# Altium schematic sheet Current_Thermal.SchDoc
size 259 x 167 mm; SheetNumber: 12; SheetTotal: 12
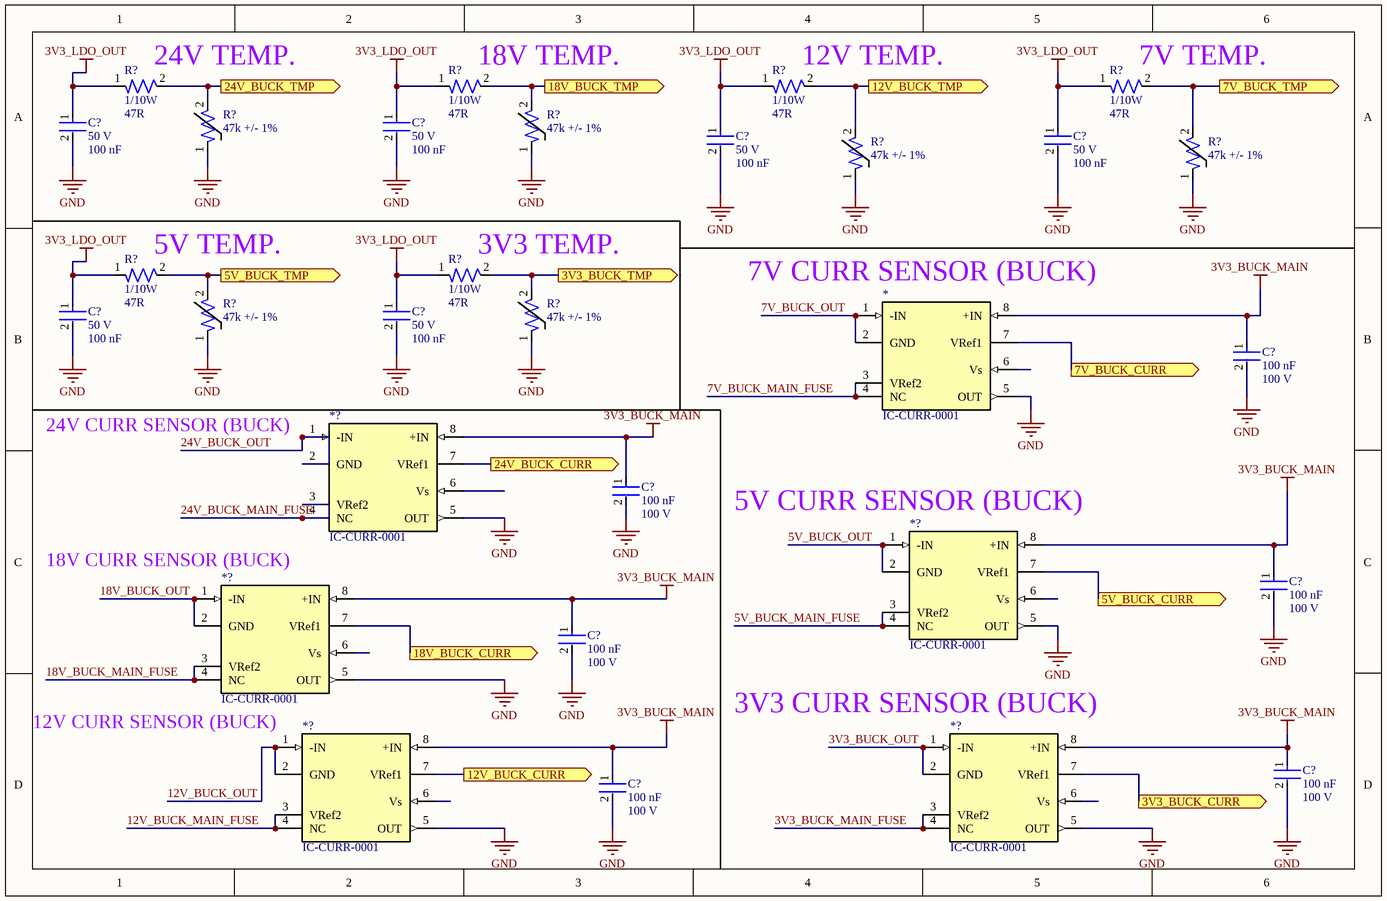
[diagram p0: Current_Thermal.SchDoc]

## Parts
(Parts that share a designator on the sheet are numbered #1, #2 ... from top to bottom, then left to right.)
*  IC-CURR-0001
*?#1  IC-CURR-0001
*?#2  IC-CURR-0001
*?#3  IC-CURR-0001
*?#4  IC-CURR-0001
*?#5  IC-CURR-0001
C?#1  Voltage Rating: 50 V  Capacitance: 100 nF  [CAP-0805]  (hidden comment: CC0805KRX7R9BB104)
C?#2  Voltage Rating: 50 V  Capacitance: 100 nF  [CAP-0805]  (hidden comment: CC0805KRX7R9BB104)
C?#3  Voltage Rating: 50 V  Capacitance: 100 nF  [CAP-0805]  (hidden comment: CC0805KRX7R9BB104)
C?#4  Voltage Rating: 50 V  Capacitance: 100 nF  [CAP-0805]  (hidden comment: CC0805KRX7R9BB104)
C?#5  Voltage Rating: 50 V  Capacitance: 100 nF  [CAP-0805]  (hidden comment: CC0805KRX7R9BB104)
C?#6  Voltage Rating: 50 V  Capacitance: 100 nF  [CAP-0805]  (hidden comment: CC0805KRX7R9BB104)
C?#7  Capacitance: 100 nF  Voltage: 100 V  [CAP-0603]  (hidden comment: CC0603KRX7R0BB104)
C?#8  Capacitance: 100 nF  Voltage: 100 V  [CAP-0603]  (hidden comment: CC0603KRX7R0BB104)
C?#9  Capacitance: 100 nF  Voltage: 100 V  [CAP-0603]  (hidden comment: CC0603KRX7R0BB104)
C?#10  Capacitance: 100 nF  Voltage: 100 V  [CAP-0603]  (hidden comment: CC0603KRX7R0BB104)
C?#11  Capacitance: 100 nF  Voltage: 100 V  [CAP-0603]  (hidden comment: CC0603KRX7R0BB104)
C?#12  Capacitance: 100 nF  Voltage: 100 V  [CAP-0603]  (hidden comment: CC0603KRX7R0BB104)
R?#1  Power: 1/10W  Resistance: 47R  [RES-0603]  (hidden comment: RC0603FR-0747RL)
R?#2  Power: 1/10W  Resistance: 47R  [RES-0603]  (hidden comment: RC0603FR-0747RL)
R?#3  Power: 1/10W  Resistance: 47R  [RES-0603]  (hidden comment: RC0603FR-0747RL)
R?#4  Power: 1/10W  Resistance: 47R  [RES-0603]  (hidden comment: RC0603FR-0747RL)
R?#5  Resistance: 47k +/- 1%  [RES-0402]  (hidden comment: TMP6431DECR)
R?#6  Resistance: 47k +/- 1%  [RES-0402]  (hidden comment: TMP6431DECR)
R?#7  Resistance: 47k +/- 1%  [RES-0402]  (hidden comment: TMP6431DECR)
R?#8  Resistance: 47k +/- 1%  [RES-0402]  (hidden comment: TMP6431DECR)
R?#9  Power: 1/10W  Resistance: 47R  [RES-0603]  (hidden comment: RC0603FR-0747RL)
R?#10  Power: 1/10W  Resistance: 47R  [RES-0603]  (hidden comment: RC0603FR-0747RL)
R?#11  Resistance: 47k +/- 1%  [RES-0402]  (hidden comment: TMP6431DECR)
R?#12  Resistance: 47k +/- 1%  [RES-0402]  (hidden comment: TMP6431DECR)

## Ports
3V3_BUCK_CURR (out), 3V3_BUCK_TMP (out), 5V_BUCK_CURR (out), 5V_BUCK_TMP (out), 7V_BUCK_CURR (out), 7V_BUCK_TMP (out), 12V_BUCK_CURR (out), 12V_BUCK_TMP (out), 18V_BUCK_CURR (out), 18V_BUCK_TMP (out), 24V_BUCK_CURR (out), 24V_BUCK_TMP (out)

## Nets
3V3_BUCK_MAIN: *.8(+IN) *?#1.8(+IN) *?#2.8(+IN) *?#3.8(+IN) *?#4.8(+IN) *?#5.8(+IN) C?#7.1 C?#8.1 C?#9.1 C?#10.1 C?#11.1 C?#12.1
3V3_LDO_OUT: C?#1.1 C?#2.1 C?#3.1 C?#4.1 C?#5.1 C?#6.1 R?#1.1 R?#2.1 R?#3.1 R?#4.1 R?#9.1 R?#10.1
GND: *.5(OUT) *?#1.5(OUT) *?#2.5(OUT) *?#3.5(OUT) *?#4.5(OUT) *?#5.5(OUT) C?#1.2 C?#2.2 C?#3.2 C?#4.2 C?#5.2 C?#6.2 C?#7.2 C?#8.2 C?#9.2 C?#10.2 C?#11.2 C?#12.2 R?#5.1 R?#6.1 R?#7.1 R?#8.1 R?#11.1 R?#12.1
3V3_BUCK_CURR: *?#5.7(VRef1) ; port 3V3_BUCK_CURR
3V3_BUCK_MAIN_FUSE: *?#5.3(VRef2) *?#5.4(NC)
3V3_BUCK_OUT: *?#5.1(-IN) *?#5.2(GND)
3V3_BUCK_TMP: R?#10.2 R?#12.2 ; port 3V3_BUCK_TMP
5V_BUCK_CURR: *?#2.7(VRef1) ; port 5V_BUCK_CURR
5V_BUCK_MAIN_FUSE: *?#2.3(VRef2) *?#2.4(NC)
5V_BUCK_OUT: *?#2.1(-IN) *?#2.2(GND)
5V_BUCK_TMP: R?#9.2 R?#11.2 ; port 5V_BUCK_TMP
7V_BUCK_CURR: *.7(VRef1) ; port 7V_BUCK_CURR
7V_BUCK_MAIN_FUSE: *.3(VRef2) *.4(NC)
7V_BUCK_OUT: *.1(-IN) *.2(GND)
7V_BUCK_TMP: R?#4.2 R?#8.2 ; port 7V_BUCK_TMP
12V_BUCK_CURR: *?#4.7(VRef1) ; port 12V_BUCK_CURR
12V_BUCK_MAIN_FUSE: *?#4.3(VRef2) *?#4.4(NC)
12V_BUCK_OUT: *?#4.1(-IN) *?#4.2(GND)
12V_BUCK_TMP: R?#3.2 R?#7.2 ; port 12V_BUCK_TMP
18V_BUCK_CURR: *?#3.7(VRef1) ; port 18V_BUCK_CURR
18V_BUCK_MAIN_FUSE: *?#3.3(VRef2) *?#3.4(NC)
18V_BUCK_OUT: *?#3.1(-IN) *?#3.2(GND)
18V_BUCK_TMP: R?#2.2 R?#6.2 ; port 18V_BUCK_TMP
24V_BUCK_CURR: *?#1.7(VRef1) ; port 24V_BUCK_CURR
24V_BUCK_MAIN_FUSE: *?#1.3(VRef2) *?#1.4(NC)
24V_BUCK_OUT: *?#1.1(-IN) *?#1.2(GND)
24V_BUCK_TMP: R?#1.2 R?#5.2 ; port 24V_BUCK_TMP

Not connected (* = marked no-connect by the designer): * 6(Vs); *?#1 6(Vs); *?#2 6(Vs); *?#3 6(Vs); *?#4 6(Vs); *?#5 6(Vs)

## Notes on the sheet
- (near R?#1) 24V TEMP.
- (near R?#2) 18V TEMP.
- (near R?#3) 12V TEMP.
- (near R?#4) 7V TEMP.
- (near R?#9) 5V TEMP.
- (near R?#10) 3V3 TEMP.
- (near *) 7V CURR SENSOR (BUCK)
- 24V CURR SENSOR (BUCK)
- (near *?#2) 5V CURR SENSOR (BUCK)
- (near *?#3) 18V CURR SENSOR (BUCK)
- (near *?#5) 3V3 CURR SENSOR (BUCK)
- (near *?#3) 12V CURR SENSOR (BUCK)

## Library data of the parts
* *?#1-*?#5 = IC-CURR-0001: Current Sense Amplifier 1 Circuit 8-MSOP
C?#1-C?#6 = CAP-0.1U-0002: CAP CER 0.1UF 50V X7R 0805; ComponentLink2Description: Datasheet; ComponentLink2URL: https://www.yageo.com/upload/media/product/productsearch/datasheet/mlcc/UPY-GPHC_X7R_6.3V-to-250V_24.pdf; Device Class: Ceramic; Size: 0805
C?#7-C?#12 = CAP-100N-0001: CAP CER 0.1UF 100V X7R 0603; Device Class: Ceramic; Size: 0603; ComponentLink1Description: Datasheet; ComponentLink1URL: https://www.yageo.com/upload/media/product/app/datasheet/mlcc/upy-np0x7r_mv_100-to-630v.pdf
R?#1-R?#4 R?#9 R?#10 = RES-47-0001: RES 47 OHM 1% 1/10W 0603; Tolerance: 1%; Size: 0603; ComponentLink1Description: Datasheet; ComponentLink1URL: https://www.yageo.com/upload/media/product/products/datasheet/rchip/PYu-RC_Group_51_RoHS_L_12.pdf
R?#5-R?#8 R?#11 R?#12 = THERM-47K-0001: PTC Thermistor 47 kOhms 0402 (1006 Metric); Manufacturer: Texas Instruments; Manufacturer Part Number: TMP6431DECR; Package Size: 0402